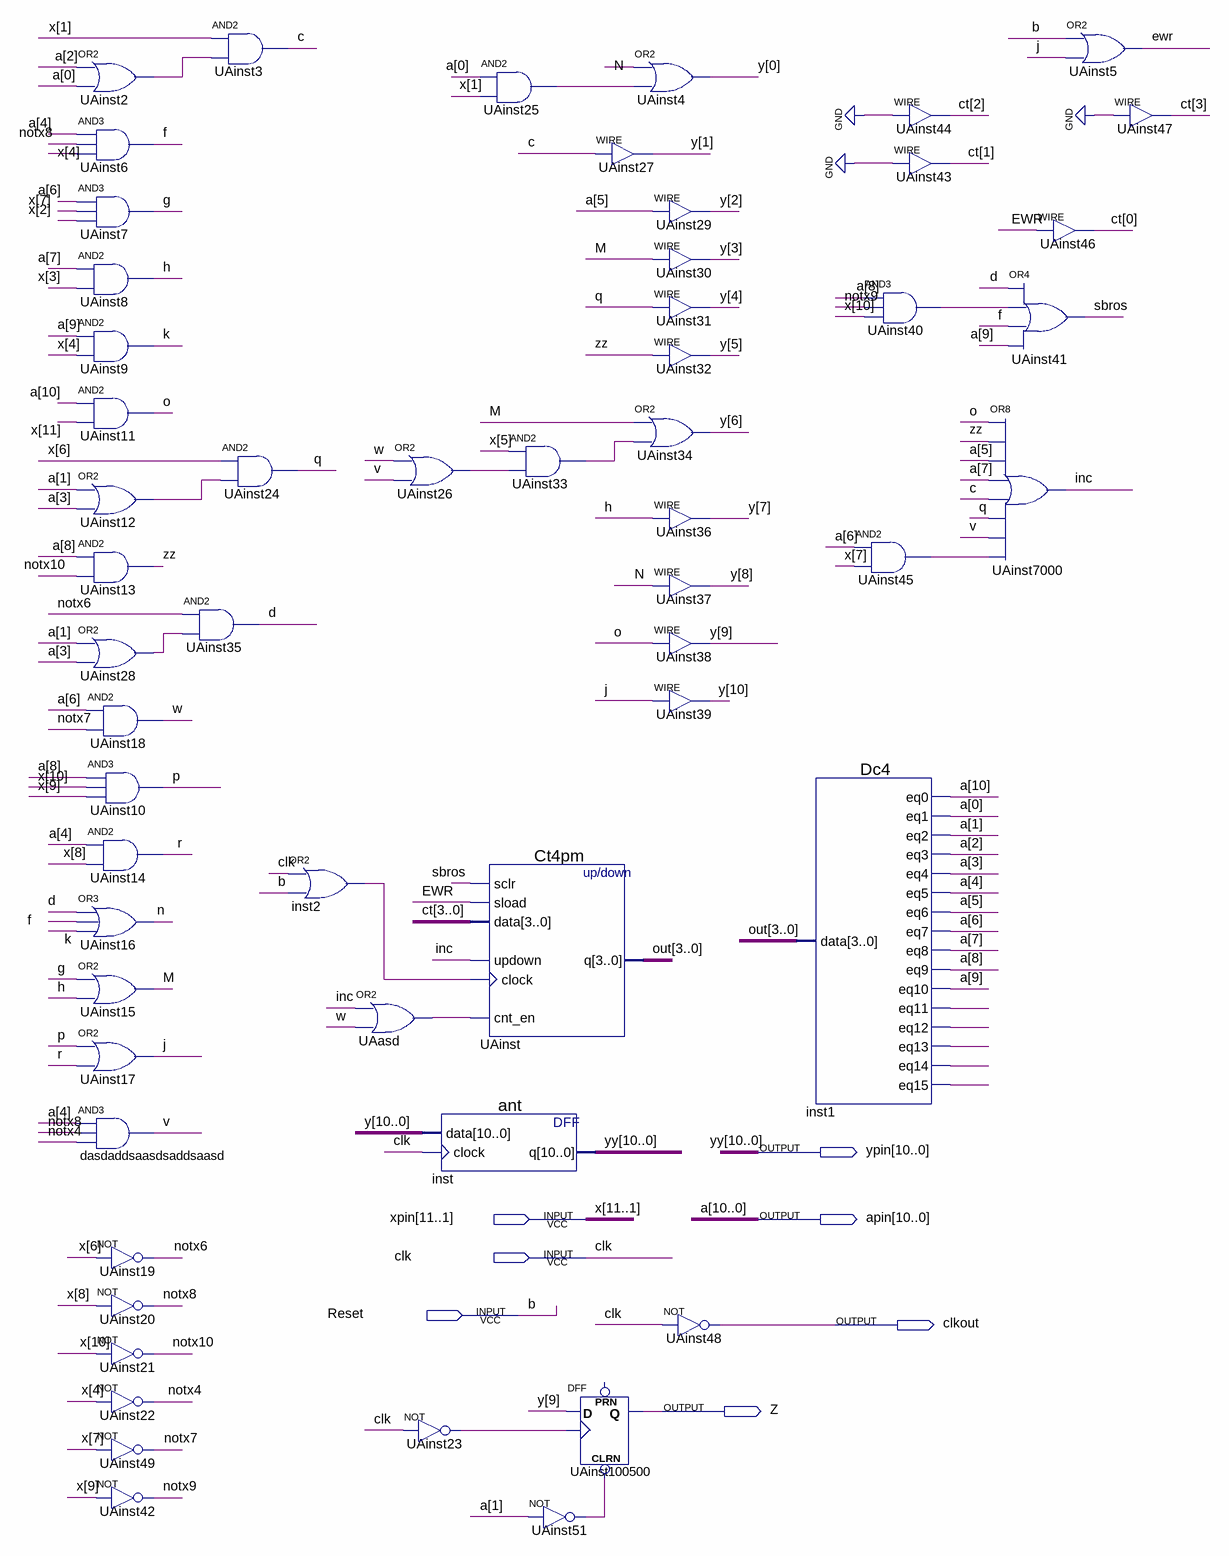
[diagram p0: schematic sheet]
// Quartus schematic UA.bdf as structural Verilog: 57 symbols, 7 pins
module UA (
  input  [11:1] xpin,
  input  clk,
  input  Reset,
  output [10:0] ypin,
  output [10:0] apin,
  output clkout,
  output Z
);

  wire c, d, EWR, f, g, h, inc, inst1_eq11, inst1_eq12, inst1_eq13, inst1_eq14, inst1_eq15, inst2_out, j, k,
       M, n, notx4, notx6, notx7, notx8, notx9, notx10, o, p, q, r, sbros, UAasd_out, UAinst2_out,
       UAinst12_out, UAinst23_out, UAinst25_out, UAinst26_out, UAinst28_out, UAinst33_out, UAinst40_out,
       UAinst45_out, UAinst51_out, v, w, zz;
  wire [3:0] ct, out;
  wire [10:0] y;

  or UAinst2 (UAinst2_out, apin[2], apin[0]);
  and UAinst6 (f, apin[4], notx8, xpin[4]);
  and UAinst7 (g, apin[6], xpin[7], xpin[2]);
  and UAinst8 (h, apin[7], xpin[3]);
  and UAinst9 (k, apin[9], xpin[4]);
  and UAinst11 (o, apin[10], xpin[11]);
  or UAinst12 (UAinst12_out, apin[1], apin[3]);
  and UAinst13 (zz, apin[8], notx10);
  or UAinst28 (UAinst28_out, apin[1], apin[3]);
  and UAinst18 (w, apin[6], notx7);
  and UAinst10 (p, apin[8], xpin[10], xpin[9]);
  and UAinst14 (r, apin[4], xpin[8]);
  or UAinst16 (n, d, f, k);
  or UAinst15 (M, g, h);
  or UAinst17 (j, p, r);
  and dasdaddsaasdsaddsaasd (v, apin[4], notx8, notx4);
  not UAinst19 (notx6, xpin[6]);
  not UAinst20 (notx8, xpin[8]);
  not UAinst21 (notx10, xpin[10]);
  not UAinst22 (notx4, xpin[4]);
  not UAinst49 (notx7, xpin[7]);
  not UAinst42 (notx9, xpin[9]);
  and UAinst3 (c, xpin[1], UAinst2_out);
  and UAinst35 (d, notx6, UAinst28_out);
  and UAinst24 (q, xpin[6], UAinst12_out);
  or inst2 (inst2_out, clk, Reset);
  or UAasd (UAasd_out, inc, w);
  or UAinst26 (UAinst26_out, w, v);
  ant inst (.data(y), .clock(clk), .q(ypin));
  not UAinst23 (UAinst23_out, clk);
  and UAinst25 (UAinst25_out, apin[0], xpin[1]);
  and UAinst33 (UAinst33_out, xpin[5], UAinst26_out);
  Ct4pm UAinst (.sclr(sbros), .sload(EWR), .data(ct), .updown(inc), .clock(inst2_out), .cnt_en(UAasd_out), .q(out));
  assign y[1] = c;  // WIRE UAinst27
  DFF UAinst100500 (.CLRN(UAinst51_out), .CLK(UAinst23_out), .D(y[9]), .Q(Z));  // open: PRN
  not UAinst51 (UAinst51_out, apin[1]);
  or UAinst4 (y[0], n, UAinst25_out);
  assign y[2] = apin[5];  // WIRE UAinst29
  assign y[3] = M;  // WIRE UAinst30
  assign y[4] = q;  // WIRE UAinst31
  assign y[5] = zz;  // WIRE UAinst32
  or UAinst34 (y[6], M, UAinst33_out);
  assign y[7] = h;  // WIRE UAinst36
  assign y[8] = n;  // WIRE UAinst37
  assign y[9] = o;  // WIRE UAinst38
  assign y[10] = j;  // WIRE UAinst39
  not UAinst48 (clkout, clk);
  Dc4 inst1 (
    .data(out), .eq0(apin[10]), .eq1(apin[0]), .eq2(apin[1]), .eq3(apin[2]), .eq4(apin[3]), .eq5(apin[4]),
    .eq6(apin[5]), .eq7(apin[6]), .eq8(apin[7]), .eq9(apin[8]), .eq10(apin[9]), .eq11(inst1_eq11),
    .eq12(inst1_eq12), .eq13(inst1_eq13), .eq14(inst1_eq14), .eq15(inst1_eq15));
  assign ct[2] = 1'b0;  // WIRE UAinst44
  assign ct[1] = 1'b0;  // WIRE UAinst43
  and UAinst40 (UAinst40_out, apin[8], notx9, xpin[10]);
  and UAinst45 (UAinst45_out, apin[6], xpin[7]);
  assign ct[0] = EWR;  // WIRE UAinst46
  or UAinst41 (sbros, d, UAinst40_out, f, apin[9]);
  or UAinst7000 (inc, o, zz, apin[5], apin[7], c, q, v, UAinst45_out);
  or UAinst5 (EWR, Reset, j);
  assign ct[3] = 1'b0;  // WIRE UAinst47

  // Other names for the same wires on the sheet: a[10:0] = apin; b = Reset; x[11:1] = xpin; yy[10:0] = ypin
endmodule
